# Altium schematic sheet Sheet1.SchDoc
size A3; SheetNumber: 1; SheetTotal: 1
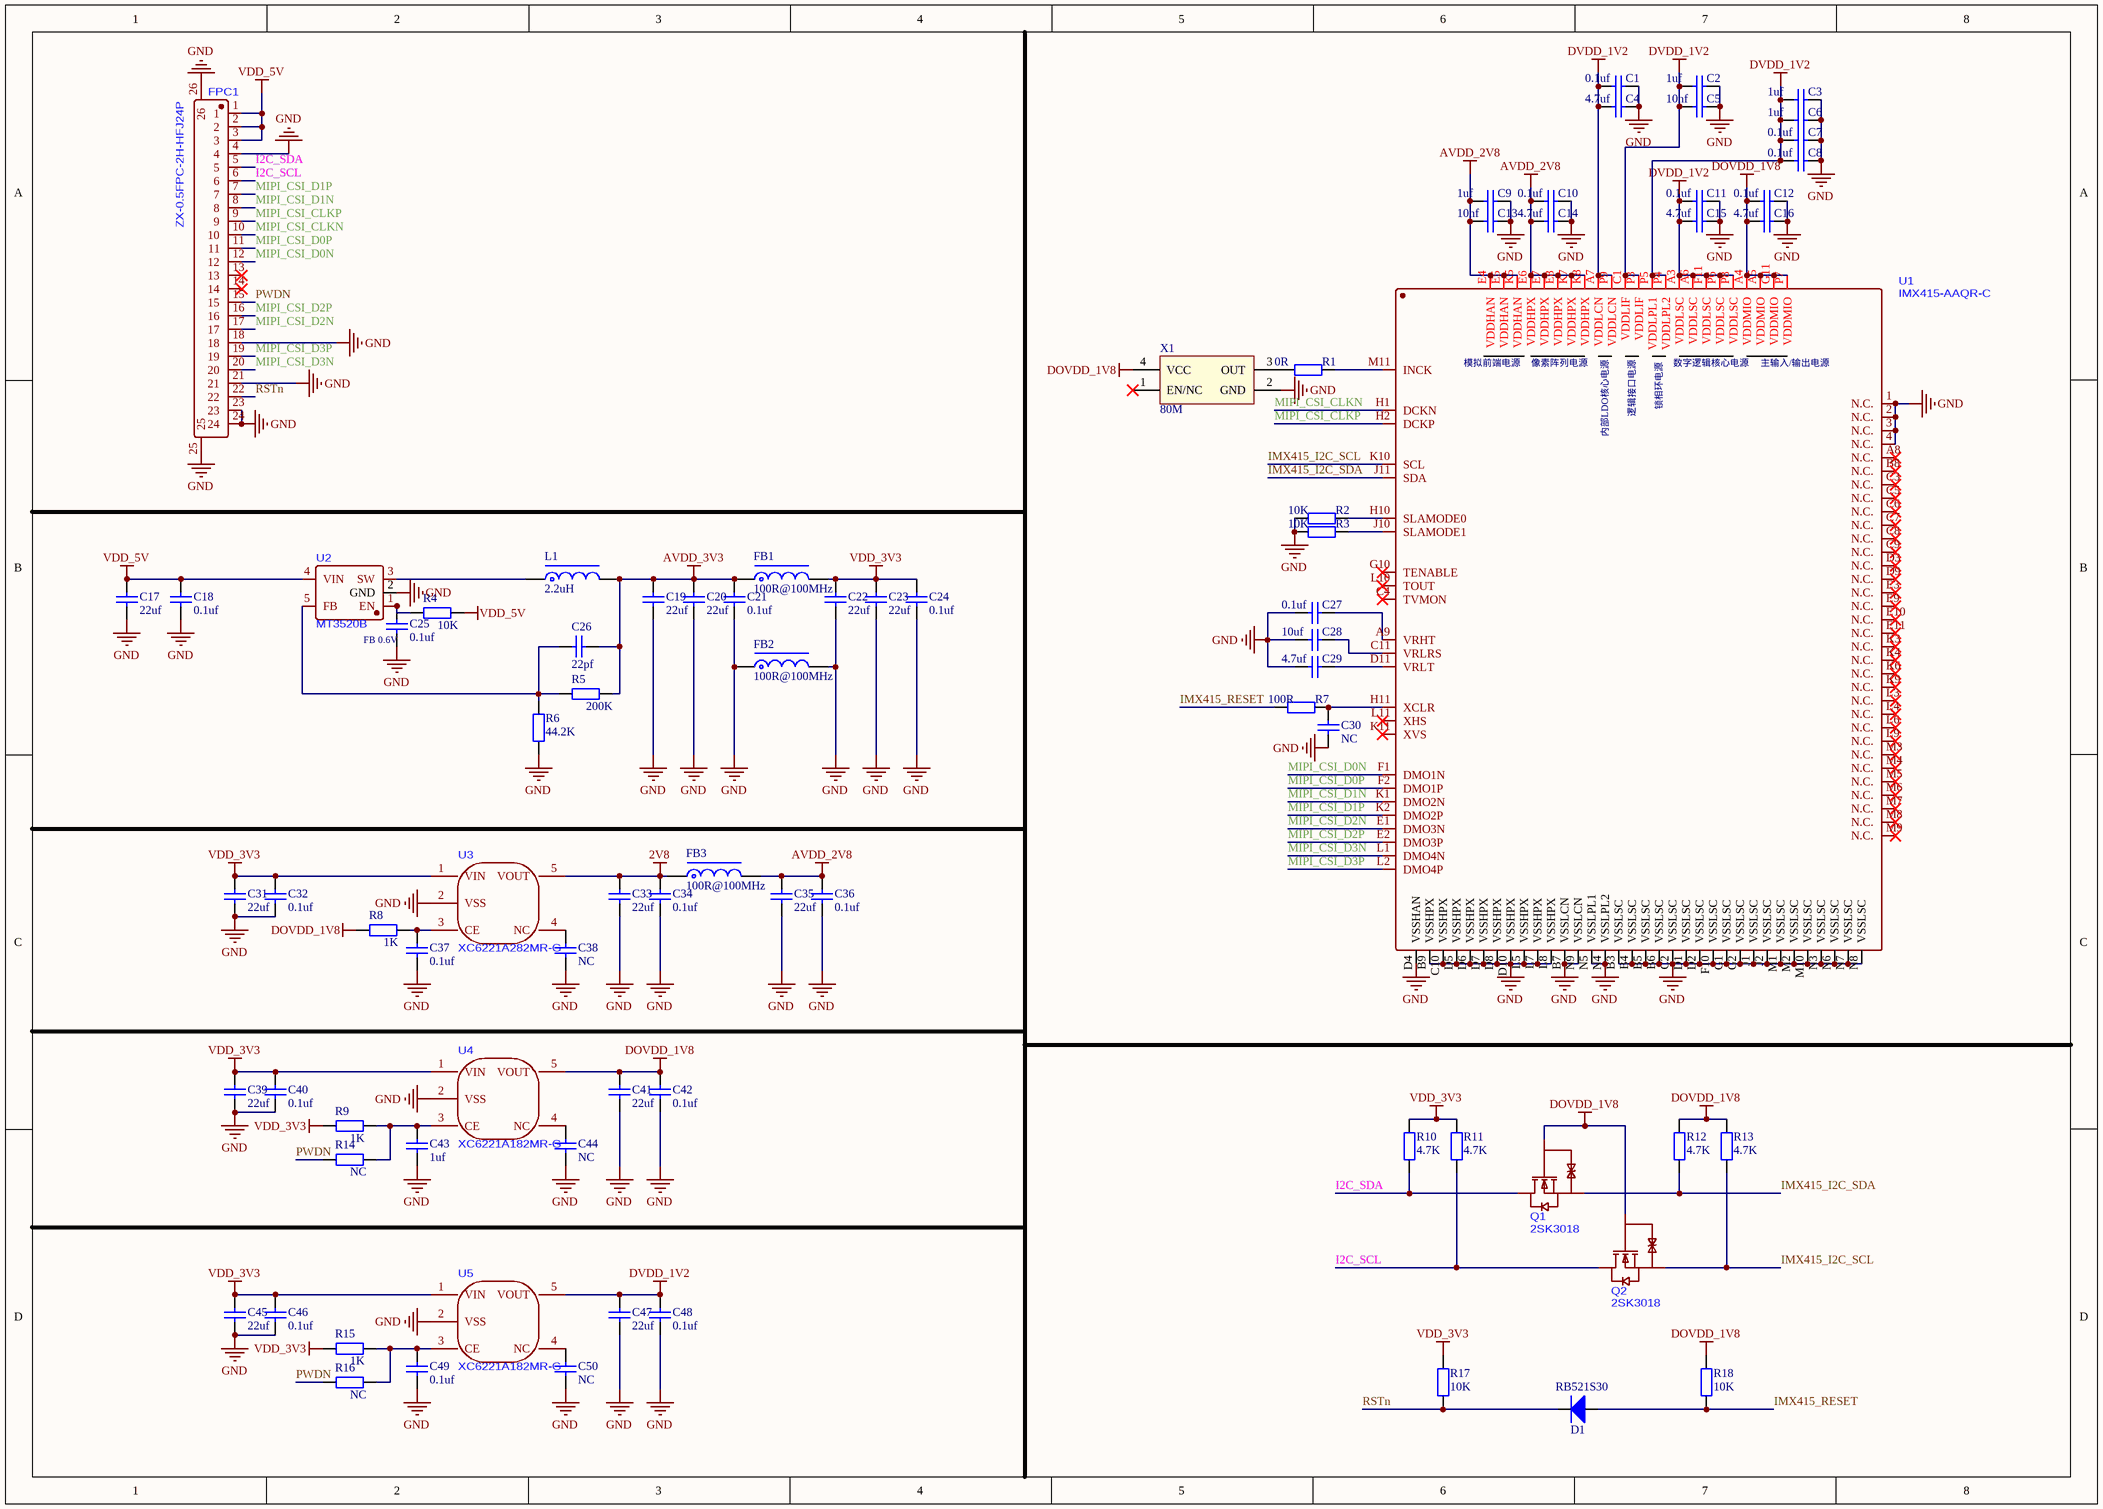
[diagram p0: Sheet1.SchDoc]

## Parts
C1  0.1uf  [C0402_L]
C2  1uf  [C0402_L]
C3  1uf  [C0402_L]
C4  4.7uf  [C0402_L]
C5  10nf  [C0402_L]
C6  1uf  [C0402_L]
C7  0.1uf  [C0402_L]
C8  0.1uf  [C0402_L]
C9  1uf  [C0402_L]
C10  0.1uf  [C0402_L]
C11  0.1uf  [C0402_L]
C12  0.1uf  [C0402_L]
C13  10nf  [C0402_L]
C14  4.7uf  [C0402_L]
C15  4.7uf  [C0402_L]
C16  4.7uf  [C0402_L]
C17  22uf  [C0603_L]
C18  0.1uf  [C0402_L]
C19  22uf  [C0603_L]
C20  22uf  [C0603_L]
C21  0.1uf  [C0402_L]
C22  22uf  [C0603_L]
C23  22uf  [C0603_L]
C24  0.1uf  [C0402_L]
C25  0.1uf  [C0402_L]
C26  22pf  [C0402_L]
C27  0.1uf  [C0402_L]
C28  10uf  [C0402_L]
C29  4.7uf  [C0402_L]
C30  NC  [C0402_L]
C31  22uf  [C0603_L]
C32  0.1uf  [C0402_L]
C33  22uf  [C0603_L]
C34  0.1uf  [C0402_L]
C35  22uf  [C0603_L]
C36  0.1uf  [C0402_L]
C37  0.1uf  [C0402_L]
C38  NC  [C0402_L]
C39  22uf  [C0603_L]
C40  0.1uf  [C0402_L]
C41  22uf  [C0603_L]
C42  0.1uf  [C0402_L]
C43  1uf  [C0402_L]
C44  NC  [C0402_L]
C45  22uf  [C0603_L]
C46  0.1uf  [C0402_L]
C47  22uf  [C0603_L]
C48  0.1uf  [C0402_L]
C49  0.1uf  [C0402_L]
C50  NC  [C0402_L]
D1  RB521S30  [SOD-323]
FB1  100R@100MHz  [FB0603]
FB2  100R@100MHz  [FB0603]
FB3  100R@100MHz  [FB0603]
FPC1  ZX-0.5FPC-2H-HFJ24P  [FPC-SMD_24P-P0.50_ZX-0.5FPC-2H-HFJ24P]
L1  2.2uH  [NR2520]
Q1  2SK3018  [SOT-23-3_L2.9-W1.3-P1.90-LS2.4-BR]
Q2  2SK3018  [SOT-23-3_L2.9-W1.3-P1.90-LS2.4-BR]
R1  0R  [R0402_L]
R2  10K  [R0402_L]
R3  10K  [R0402_L]
R4  10K  [R0402_L]
R5  200K  [R0402_L]
R6  44.2K  [R0402_L]
R7  100R  [R0402_L]
R8  1K  [R0402_L]
R9  1K  [R0402_L]
R10  4.7K  [R0402_L]
R11  4.7K  [R0402_L]
R12  4.7K  [R0402_L]
R13  4.7K  [R0402_L]
R14  NC  [R0402_L]
R15  1K  [R0402_L]
R16  NC  [R0402_L]
R17  10K  [R0402_L]
R18  10K  [R0402_L]
U1  IMX415-AAQR-C  [BGA-110_L12.0-W9.3-BL_IMX415-AAQR-C]
U2  MT3520B  [SOT-23-5_L3.0-W1.7-P0.95-LS2.8-BR]
U3  XC6221A282MR-G  [SOT-23-5_L3.0-W1.7-P0.95-LS2.8-BR]
U4  XC6221A182MR-G  [SOT-23-5_L3.0-W1.7-P0.95-LS2.8-BR]
U5  XC6221A182MR-G  [SOT-23-5_L3.0-W1.7-P0.95-LS2.8-BR]
X1  80M  [OSC-3225-4P]

## Nets
2V8: C33.2 C34.2 FB3.1 U3.5(VOUT)
AVDD_2V8: C9.2 C10.2 C13.2 C14.2 C35.2 C36.2 FB3.2 U1.E4(VDDHAN) U1.E5(VDDHAN) U1.E6(VDDHPX) U1.E7(VDDHPX) U1.E8(VDDHPX) U1.K5(VDDHAN) U1.K7(VDDHPX) U1.K8(VDDHPX)
AVDD_3V3: C19.2 C20.2 C21.2 C26.1 FB1.1 L1.2 R5.2
DOVDD_1V8: C12.2 C16.2 C41.2 C42.2 Q1.1(G) Q2.1(G) R8.1 R12.2 R13.2 R18.2 U1.A4(VDDMIO) U1.A5(VDDMIO) U1.G11(VDDMIO) U1.P7(VDDMIO) U4.5(VOUT) X1.4(VCC)
DVDD_1V2: C1.2 C2.2 C3.2 C4.2 C5.2 C6.2 C7.2 C8.2 C11.2 C15.2 C47.2 C48.2 U1.A3(VDDLSC) U1.A6(VDDLSC) U1.A7(VDDLCN) U1.C1(VDDLIF) U1.F11(VDDLSC) U1.P3(VDDLIF) U1.P4(VDDLPL2) U1.P5(VDDLPL1) U1.P6(VDDLSC) U1.P8(VDDLSC) U1.P9(VDDLCN) U5.5(VOUT)
GND: C1.1 C2.1 C3.1 C4.1 C5.1 C6.1 C7.1 C8.1 C9.1 C10.1 C11.1 C12.1 C13.1 C14.1 C15.1 C16.1 C17.1 C18.1 C19.1 C20.1 C21.1 C22.1 C23.1 C24.1 C25.1 C27.2 C28.2 C29.2 C30.1 C31.1 C32.1 C33.1 C34.1 C35.1 C36.1 C37.1 C38.1 C39.1 C40.1 C41.1 C42.1 C43.1 C44.1 C45.1 C46.1 C47.1 C48.1 C49.1 C50.1 FB2.1 FB2.2 FPC1.4 FPC1.18 FPC1.21 FPC1.23 FPC1.24 FPC1.25 FPC1.26 R2.1 R3.1 R6.1 U1.1(N.C.) U1.2(N.C.) U1.3(N.C.) U1.4(N.C.) U1.B3(VSSLSC) U1.B4(VSSLSC) U1.B5(VSSLSC) U1.B6(VSSLSC) U1.B7(VSSLCN) U1.B9(VSSHPX) U1.C2(VSSLSC) U1.C10(VSSHPX) U1.D1(VSSLSC) U1.D2(VSSLSC) U1.D4(VSSHAN) U1.D5(VSSHPX) U1.D6(VSSHPX) U1.D7(VSSHPX) U1.D8(VSSHPX) U1.D10(VSSHPX) U1.F10(VSSLSC) U1.G1(VSSLSC) U1.G2(VSSLSC) U1.J1(VSSLSC) U1.J2(VSSLSC) U1.L5(VSSHPX) U1.L7(VSSHPX) U1.L8(VSSHPX) U1.M1(VSSLSC) U1.M2(VSSLSC) U1.M10(VSSLSC) U1.N3(VSSLSC) U1.N4(VSSLPL2) U1.N5(VSSLPL1) U1.N6(VSSLSC) U1.N7(VSSLSC) U1.N8(VSSLSC) U1.N9(VSSLCN) U2.2(GND) U3.2(VSS) U4.2(VSS) U5.2(VSS) X1.2(GND)
VDD_3V3: C22.2 C23.2 C24.2 C31.2 C32.2 C39.2 C40.2 C45.2 C46.2 FB1.2 R9.1 R10.2 R11.2 R15.1 R17.2 U3.1(VIN) U4.1(VIN) U5.1(VIN)
VDD_5V: C17.2 C18.2 FPC1.1 FPC1.2 FPC1.3 R4.2 U2.4(VIN)
I2C_SCL: FPC1.6 Q2.3(D) R11.1
I2C_SDA: FPC1.5 Q1.3(D) R10.1
IMX415_I2C_SCL: Q2.2(S) R13.1 U1.K10(SCL)
IMX415_I2C_SDA: Q1.2(S) R12.1 U1.J11(SDA)
IMX415_RESET: D1.1(A) R7.1 R18.1
MIPI_CSI_CLKN: FPC1.10 U1.H1(DCKN)
MIPI_CSI_CLKP: FPC1.9 U1.H2(DCKP)
MIPI_CSI_D0N: FPC1.12 U1.F1(DMO1N)
MIPI_CSI_D0P: FPC1.11 U1.F2(DMO1P)
MIPI_CSI_D1N: FPC1.8 U1.K1(DMO2N)
MIPI_CSI_D1P: FPC1.7 U1.K2(DMO2P)
MIPI_CSI_D2N: FPC1.17 U1.E1(DMO3N)
MIPI_CSI_D2P: FPC1.16 U1.E2(DMO3P)
MIPI_CSI_D3N: FPC1.20 U1.L1(DMO4N)
MIPI_CSI_D3P: FPC1.19 U1.L2(DMO4P)
PWDN: FPC1.15 R14.1 R16.1
RSTn: D1.2(K) FPC1.22 R17.1
NetC25_2: C25.2 R4.1 U2.1(EN)
NetC26_2: C26.2 R5.1 R6.2 U2.5(FB)
NetC27_1: C27.1 U1.A9(VRHT)
NetC28_1: C28.1 U1.C11(VRLRS)
NetC29_1: C29.1 U1.D11(VRLT)
NetC30_2: C30.2 R7.2 U1.H11(XCLR)
NetC37_2: C37.2 R8.2 U3.3(CE)
NetC38_2: C38.2 U3.4(NC)
NetC43_2: C43.2 R9.2 R14.2 U4.3(CE)
NetC44_2: C44.2 U4.4(NC)
NetC49_2: C49.2 R15.2 R16.2 U5.3(CE)
NetC50_2: C50.2 U5.4(NC)
NetL1_1: L1.1 U2.3(SW)
NetR1_1: R1.1 X1.3(OUT)
NetR1_2: R1.2 U1.M11(INCK)
NetR2_2: R2.2 U1.H10(SLAMODE0)
NetR3_2: R3.2 U1.J10(SLAMODE1)

Not connected (* = marked no-connect by the designer): FPC1 13* 14*; U1 A8(N.C.)* B8(N.C.)* C3(N.C.)* C4(TVMON)* C5(N.C.)* C6(N.C.)* C7(N.C.)* C8(N.C.)* C9(N.C.)* D3(N.C.)* D9(N.C.)* E3(N.C.)* E9(N.C.)* E10(N.C.)* E11(N.C.)* G10(TENABLE)* K3(N.C.)* K4(N.C.)* K6(N.C.)* K9(N.C.)* K11(XVS)* L3(N.C.)* L4(N.C.)* L6(N.C.)* L9(N.C.)* L10(TOUT)* L11(XHS)* M3(N.C.)* M4(N.C.)* M5(N.C.)* M6(N.C.)* M7(N.C.)* M8(N.C.)* M9(N.C.)*; X1 1(EN/NC)*

## Notes on the sheet
- (near U1) 模拟前端电源
- (near U1) 像素阵列电源
- (near U1) 数字逻辑核心电源
- (near U1) 主输入/输出电源
- (near U1) 内部LDO核心电源
- (near U1) 逻辑接口电源
- (near U1) 锁相环电源
- (near C25) FB 0.6V

## Library data of the parts
C1-C50 = C: 贴片电容/MLCC电容
D1 = TVS
FB1-FB3 = FB: 贴片磁珠
L1 = L-NR: 太诱-NR磁胶电感
R1-R18 = R: 贴片电阻
U4 U5 = XC6221A282MR-G
X1 = XTAL-ACT-4P: 4脚有源晶振(振荡器)